# Altium schematic sheet source.SchDoc
size A4
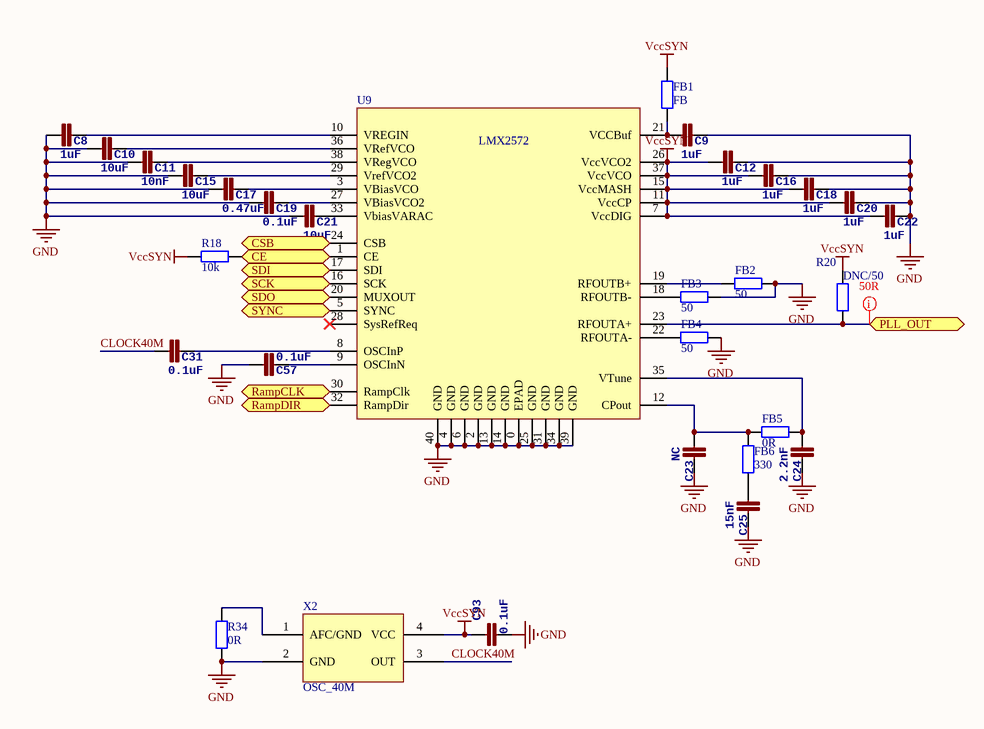
[diagram p0: source.SchDoc]

## Parts
C8  1uF  [0201]
C9  1uF  [0201]
C10  10uF  [0402]
C11  10nF  [0201]
C12  1uF  [0201]
C15  10uF  [0402]
C16  1uF  [0201]
C17  0.47uF  [0402]
C18  1uF  [0201]
C19  0.1uF  [0201]
C20  1uF  [0201]
C21  10uF  [0402]
C22  1uF  [0201]
C23  NC  [0201]
C24  2.2nF  [0201]
C25  15nF  [0201]
C31  0.1uF  [0201]
C57  0.1uF  [0201]
C93  0.1uF  [0402]
FB1  FB  [0402]
FB2  50  [0201]
FB3  50  [0201]
FB4  50  [0402]
FB5  0R  [0201]
FB6  330  [0201]
R18  10k  [0402]
R20  DNC/50  [0402]
R34  0R  [0402]
U9  LMX2572  [LMX2572]
X2  OSC_40M  [TXC_7Q]

## Ports
CE, CSB, PLL_OUT, RampCLK, RampDIR, SCK, SDI, SDO, SYNC

## Nets
GND: C8.1 C9.2 C10.1 C11.1 C12.2 C15.1 C16.2 C17.1 C18.2 C19.1 C20.2 C21.1 C22.2 C23.2 C24.2 C25.2 C57.1 C93.2 FB2.1 FB3.1 FB4.1 R34.2 U9.0(EPAD) U9.2(GND) U9.4(GND) U9.6(GND) U9.13(GND) U9.14(GND) U9.25(GND) U9.31(GND) U9.34(GND) U9.39(GND) U9.40(GND) X2.2(GND)
VccSYN: C12.1 C16.1 C18.1 C20.1 C22.1 C93.1 FB1.1 R18.1 R20.1 U9.7(VccDIG) U9.11(VccCP) U9.15(VccMASH) U9.26(VccVCO2) U9.37(VccVCO) X2.4(VCC)
CE: R18.2 U9.1(CE) ; port CE
CLOCK40M: C31.1 X2.3(OUT)
CSB: U9.24(CSB) ; port CSB
PLL_OUT: R20.2 U9.23(RFOUTA+) ; port PLL_OUT
RampCLK: U9.30(RampClk) ; port RampCLK
RampDIR: U9.32(RampDir) ; port RampDIR
SCK: U9.16(SCK) ; port SCK
SDI: U9.17(SDI) ; port SDI
SDO: U9.20(MUXOUT) ; port SDO
SYNC: U9.5(SYNC) ; port SYNC
NetC8_2: C8.2 U9.10(VREGIN)
NetC9_1: C9.1 FB1.2 U9.21(VCCBuf)
NetC10_2: C10.2 U9.36(VRefVCO)
NetC11_2: C11.2 U9.38(VRegVCO)
NetC15_2: C15.2 U9.29(VrefVCO2)
NetC17_2: C17.2 U9.3(VBiasVCO)
NetC19_2: C19.2 U9.27(VBiasVCO2)
NetC21_2: C21.2 U9.33(VbiasVARAC)
NetC23_1: C23.1 FB5.2 FB6.2 U9.12(CPout)
NetC24_1: C24.1 FB5.1 U9.35(VTune)
NetC25_1: C25.1 FB6.1
NetC31_2: C31.2 U9.8(OSCInP)
NetC57_2: C57.2 U9.9(OSCInN)
NetFB2_2: FB2.2 U9.19(RFOUTB+)
NetFB3_2: FB3.2 U9.18(RFOUTB-)
NetFB4_2: FB4.2 U9.22(RFOUTA-)
NetR34_1: R34.1 X2.1(AFC/GND)

Not connected (* = marked no-connect by the designer): U9 28(SysRefReq)*

## Layout directives
net class 50R: PLL_OUT

## Library data of the parts
C8-C12 C15-C25 C31 C57 C93 = CAP0402-CAP: <b>Capacitor</b> / Standard 0603 ceramic capacitor, and 0.1" leaded capacitor.; PARTNO: CC0402ZRY5V7BB104
FB1-FB6 R18 R20 = Res2: Resistor; Published: 8-Jun-2000; LatestRevisionDate: 17-Jul-2002; LatestRevisionNote: Re-released for DXP Platform.; PackageReference: AXIAL-0.4; Publisher: Altium Limited; PackageDescription: Axial Device, Thru-Hole; 2 Leads; 0.4 in Pin Spacing
R34 = Res2: Resistor; Value: 0Ohm; Published: 8-Jun-2000; LatestRevisionDate: 17-Jul-2002; LatestRevisionNote: Re-released for DXP Platform.; PackageReference: AXIAL-0.4; Publisher: Altium Limited; PackageDescription: Axial Device, Thru-Hole; 2 Leads; 0.4 in Pin Spacing